# Altium schematic sheet USB-C.SchDoc
size A4; SheetNumber: 4; SheetTotal: 5
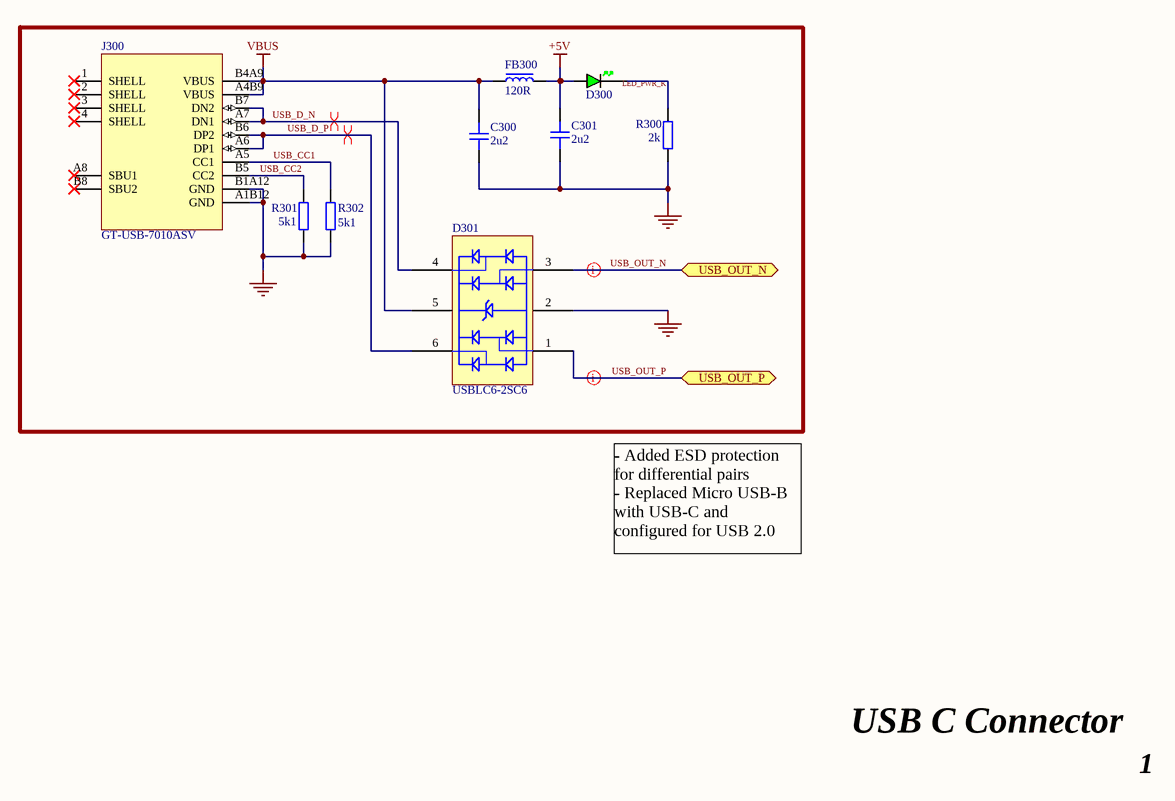
[diagram p0: USB-C.SchDoc]

## Parts
C300  2u2  [CAP_0603]
C301  2u2  [CAP_0603]
D300  GREEN  [LED_0603_GREEN]  (value not drawn)
D301  USBLC6-2SC6  [USBLC6-2SC6]
FB300  120R  [FB_0603]
J300  GT-USB-7010ASV  [GT-USB-7010ASV]
R300  2k  [RES_0603]
R301  5k1  [RES_0603]
R302  5k1  [RES_0603]

## Ports
USB_OUT_N (bidir, see Thrust Stand Controller Revised[2B], MCU[1B]), USB_OUT_P (bidir, see Thrust Stand Controller Revised[2C], MCU[1B])

## Nets
+5V: C301.2 D300.A FB300.2
GND: C300.1 C301.1 D301.2 J300.A1B12(GND) J300.B1A12(GND) R300.1 R301.1 R302.1
VBUS: C300.2 D301.5 FB300.1 J300.A4B9(VBUS) J300.B4A9(VBUS)
LED_PWR_K: D300.K R300.2
USB_CC1: J300.A5(CC1) R302.2
USB_CC2: J300.B5(CC2) R301.2
USB_D_N: D301.4 J300.A7(DN1) J300.B7(DN2)
USB_D_P: D301.6 J300.A6(DP1) J300.B6(DP2)
USB_OUT_N: D301.3 ; port USB_OUT_N
USB_OUT_P: D301.1 ; port USB_OUT_P

Not connected (* = marked no-connect by the designer): J300 1(SHELL)* 2(SHELL)* 3(SHELL)* 4(SHELL)* A8(SBU1)* B8(SBU2)*

## Layout directives
differential pair; differential pair class USB_OUT: USB_OUT_N, USB_OUT_P
differential pair; differential pair class DIFF_USB; rule Differential Pairs Routing [Pref Gap = 0.203mm    Min Gap  = 0.203mm    Max Gap  = 0.203mmPref Width = 0.281mm    Min Width  = 0.281mm    Max Width  = 0.281mm]: USB_D_N, USB_D_P

## Notes on the sheet
- - Added ESD protection for differential pairs                - Replaced Micro USB-B with USB-C and configured for USB 2.0
- USB C Connector
- 1

## Library data of the parts
C300 C301 = CAP_0603: Capacitor SMD 0603; Manufacturer: *; Manufacturer Part Number: *; Distributor Link: *; LCSC: *; Rating: *; Dielectric: *
D300 = LED_0603_GREEN: LED 0603 GREEN SMD
D301 = USBLC6-2SC6: 5A 17V 6V Unidirectional 5.25V SOT-23-6 ESD and Surge Protection (TVS/ESD) ROHS; Manufacturer: STMicroelectronics; MFR. Part Number: USBLC6-2SC6; JLCPCB Part Number: C7519; Supplier 1: Future Electronics; Supplier Part Number 1: 5742044
FB300 = FB_0603: Ferrite Bead SMD 0603; Manufacturer: *; Manufacturer Part Number: *; Distributor Link: *; LCSC: *
J300 = GT-USB-7010ASV: USB 2.0 3A 1 260℃ Horizontal attachment 16P Female -40℃~+85℃ Gold High conductivity copper Type-C SMD USB Connectors ROHS; Manufacturer: G-Switch; MFR. Part #: GT-USB-7010ASV; JLCPCB Part #: C2988369; Package: SMD
R300-R302 = RES_0603: Resistor SMD 0603; Manufacturer: *; Manufacturer Part Number: *; Distributor Link: *; LCSC: *